# EAGLE schematic attiniest85-display-shield-mk-1.0 (EAGLE 6.5.0)
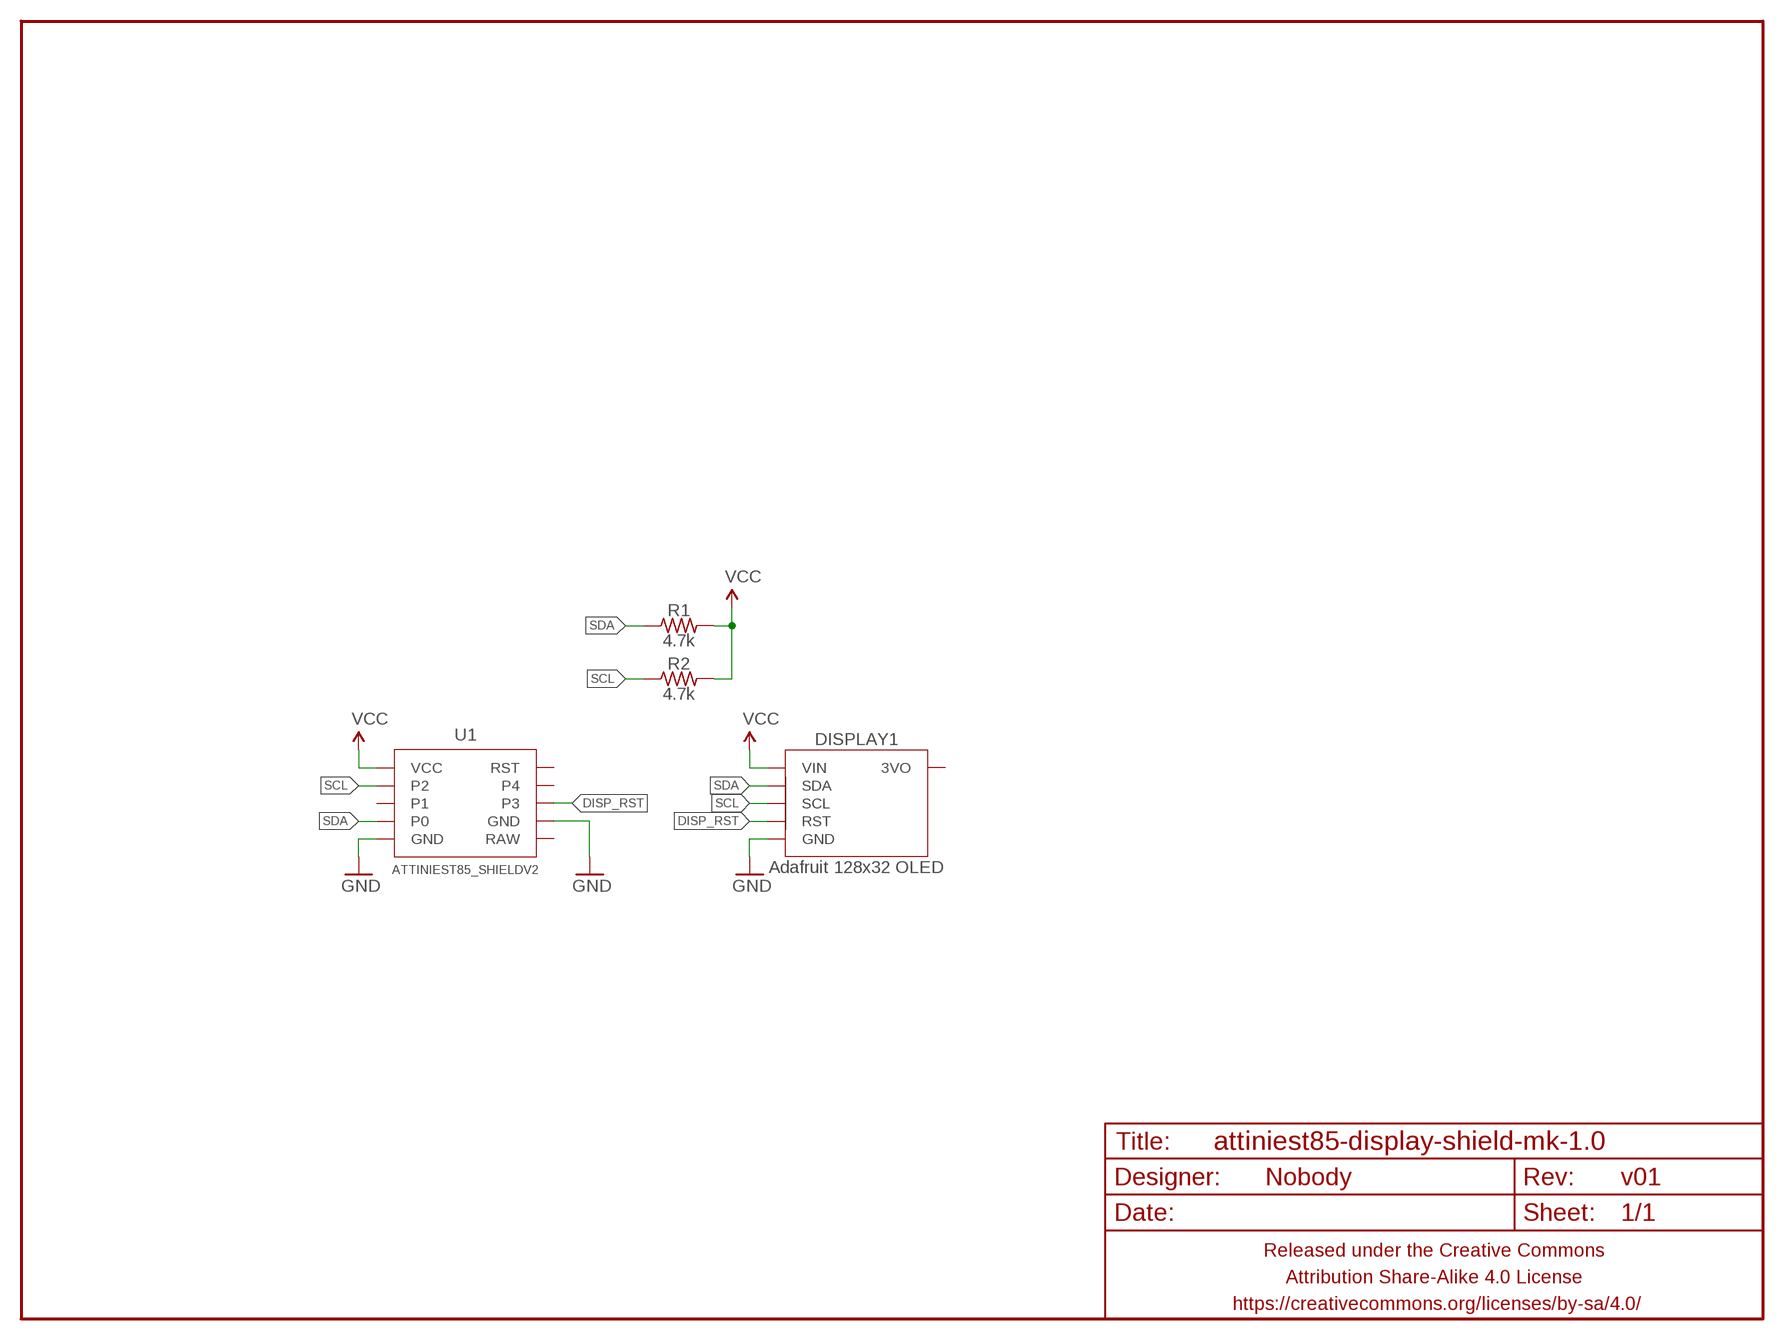
[diagram p0: schematic, sheet 1]

## Parts
DISPLAY1  Adafruit 128x32 OLED  ADAFRUIT_128X32_OLED_I2CNOHOLES  [ADAFRUIT_128X32_OLED_I2C_CLOSER_NOHOLES]
FRAME1  FRAME-LETTERNO_PACKAGE  [DUMMY]
R1  4.7k  RESISTORPTH-AXIAL-7.62MM  [RESISTOR-AXIAL-PTH-7.62MM]
R2  4.7k  RESISTORPTH-AXIAL-7.62MM  [RESISTOR-AXIAL-PTH-7.62MM]
U1  ATTINIEST85_SHIELDV2  [ATTINIEST85_SHIELD_V2]

## Nets
DISP_RST: DISPLAY1.RST U1.3
GND: DISPLAY1.GND U1.GND@1(GND) U1.GND@2(GND)
SCL: DISPLAY1.SCL R2.P$1 U1.2
SDA: DISPLAY1.SDA R1.P$1 U1.0
VCC: DISPLAY1.VIN R1.P$2 R2.P$2 U1.VCC
Unconnected: DISPLAY1.3VO U1.1 U1.4 U1.RAW U1.RST

## Library data of the parts
DISPLAY1 = A_butts:ADAFRUIT_128X32_OLED_I2C
FRAME1 = A_butts:FRAME-LETTER: Schematic Frame Standard 8.5x11 US Letter frame; DESIGNER: Nobody; VERSION: v01
R1 R2 = A_butts:RESISTOR: RESISTOR, American symbol
U1 = A_butts:ATTINIEST85_SHIELD